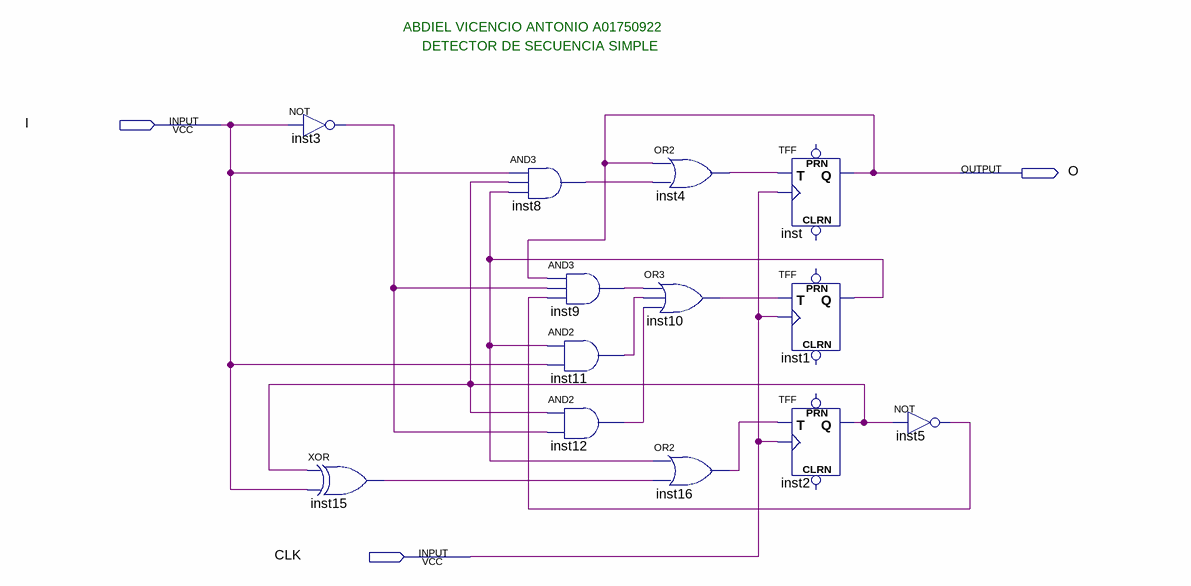
[diagram p0: schematic sheet]
// Quartus schematic DETECTORDESECUENCIASIMPLE2.bdf as structural Verilog: 13 symbols, 3 pins
module DETECTORDESECUENCIASIMPLE2 (
  input  I,
  input  CLK,
  output O
);

  wire inst1_q, inst2_q, inst3_out, inst4_out, inst5_out, inst8_out, inst9_out, inst10_out, inst11_out,
       inst12_out, inst15_out, inst16_out;

  not inst3 (inst3_out, I);
  xor inst15 (inst15_out, inst2_q, I);
  and inst8 (inst8_out, I, inst2_q, inst1_q);
  and inst9 (inst9_out, O, inst3_out, inst5_out);
  and inst11 (inst11_out, inst1_q, I);
  and inst12 (inst12_out, inst2_q, inst3_out);
  or inst10 (inst10_out, inst9_out, inst11_out, inst12_out);
  or inst4 (inst4_out, O, inst8_out);
  or inst16 (inst16_out, inst1_q, inst15_out);
  TFF inst (.T(inst4_out), .CLK(CLK), .Q(O));  // open: PRN, CLRN
  TFF inst1 (.T(inst10_out), .CLK(CLK), .Q(inst1_q));  // open: PRN, CLRN
  TFF inst2 (.T(inst16_out), .CLK(CLK), .Q(inst2_q));  // open: PRN, CLRN
  not inst5 (inst5_out, inst2_q);

  // Notes on the sheet:
  //   ABDIEL VICENCIO ANTONIO A01750922
  //   DETECTOR DE SECUENCIA SIMPLE
endmodule
